# EAGLE design projeto_placa (EAGLE 7.7.0)
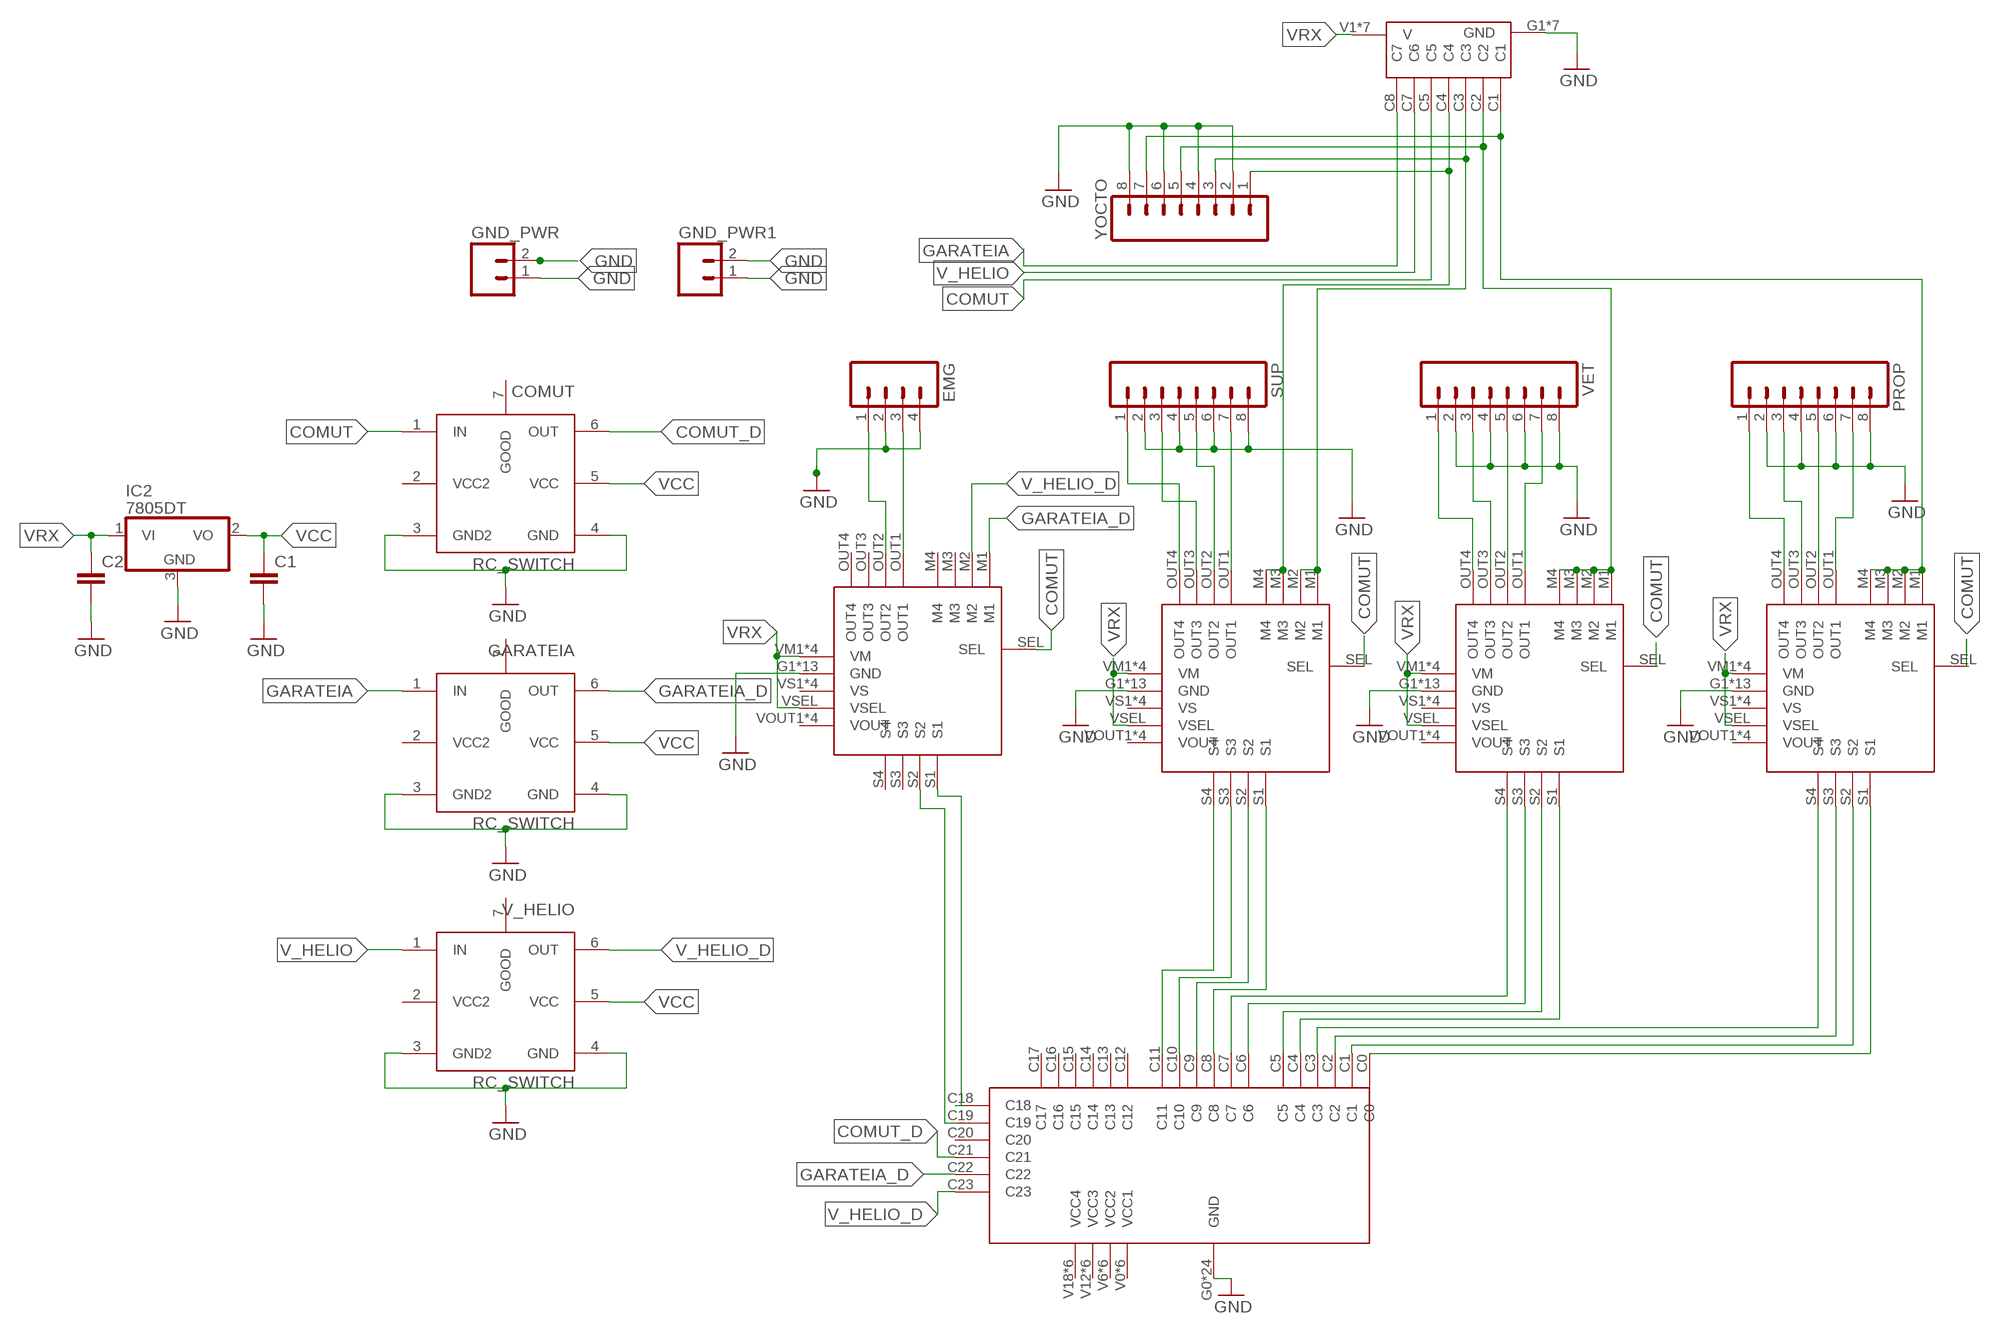
[diagram p0: schematic, sheet 1]

## Parts
C1  C-EUC0805  [C0805]
C2  C-EUC0805  [C0805]
COMUT  RC_SWITCH  [7PINS_POLOLU]
EMG  M04PTH  [1X04]
GARATEIA  RC_SWITCH  [7PINS_POLOLU]
GND_PWR  M025MM  [SCREWTERMINAL-5MM-2]
GND_PWR1  M025MM  [SCREWTERMINAL-5MM-2]
IC2  7805DT  [TO252]
PROP  M08  [1X08_ROUND]
RX_IN  RX_IN  [RX_IN]
SUP  M08  [1X08_ROUND]
U$1  POLOLU_MAESTRO_24CH  [POLOLU_MAESTRO_24]
U$3  POLOLU_MUX_4CH  [POLOLU_MUX]
U$4  POLOLU_MUX_4CH  [POLOLU_MUX]
U$5  POLOLU_MUX_4CH  [POLOLU_MUX]
U$6  POLOLU_MUX_4CH  [POLOLU_MUX]
V_HELIO  RC_SWITCH  [7PINS_POLOLU]
VET  M08  [1X08_ROUND]
YOCTO  M08SILK_FEMALE_PTH  [1X08]

## Nets
COMUT: COMUT.1(IN) RX_IN.C5 U$3.SEL U$4.SEL U$5.SEL U$6.SEL
COMUT_D: COMUT.6(OUT) U$1.C21
GARATEIA: GARATEIA.1(IN) RX_IN.C8(C7)
GARATEIA_D: GARATEIA.6(OUT) U$1.C22 U$6.M1
GND: C1.2 C2.2 COMUT.3(GND2) COMUT.4(GND) EMG.2 EMG.4 GARATEIA.3(GND2) GARATEIA.4(GND) GND_PWR1.1 GND_PWR1.2 GND_PWR.1 GND_PWR.2 IC2.3(GND) PROP.2 PROP.4 PROP.6 PROP.8 RX_IN.G1(GND) RX_IN.G2(GND) RX_IN.G3(GND) RX_IN.G4(GND) RX_IN.G5(GND) RX_IN.G6(GND) RX_IN.G7(GND) SUP.2 SUP.4 SUP.6 SUP.8 U$1.G0(GND) U$1.G1(GND) U$1.G2(GND) U$1.G3(GND) U$1.G4(GND) U$1.G5(GND) U$1.G6(GND) U$1.G7(GND) U$1.G8(GND) U$1.G9(GND) U$1.G10(GND) U$1.G11(GND) U$1.G12(GND) U$1.G13(GND) U$1.G14(GND) U$1.G15(GND) U$1.G16(GND) U$1.G17(GND) U$1.G18(GND) U$1.G19(GND) U$1.G20(GND) U$1.G21(GND) U$1.G22(GND) U$1.G23(GND) U$3.G1(GND) U$3.G2(GND) U$3.G3(GND) U$3.G4(GND) U$3.G5(GND) U$3.G6(GND) U$3.G7(GND) U$3.G8(GND) U$3.G9(GND) U$3.G10(GND) U$3.G11(GND) U$3.G12(GND) U$3.G13(GND) U$4.G1(GND) U$4.G2(GND) U$4.G3(GND) U$4.G4(GND) U$4.G5(GND) U$4.G6(GND) U$4.G7(GND) U$4.G8(GND) U$4.G9(GND) U$4.G10(GND) U$4.G11(GND) U$4.G12(GND) U$4.G13(GND) U$5.G1(GND) U$5.G2(GND) U$5.G3(GND) U$5.G4(GND) U$5.G5(GND) U$5.G6(GND) U$5.G7(GND) U$5.G8(GND) U$5.G9(GND) U$5.G10(GND) U$5.G11(GND) U$5.G12(GND) U$5.G13(GND) U$6.G1(GND) U$6.G2(GND) U$6.G3(GND) U$6.G4(GND) U$6.G5(GND) U$6.G6(GND) U$6.G7(GND) U$6.G8(GND) U$6.G9(GND) U$6.G10(GND) U$6.G11(GND) U$6.G12(GND) U$6.G13(GND) V_HELIO.3(GND2) V_HELIO.4(GND) VET.2 VET.4 VET.6 VET.8 YOCTO.2 YOCTO.4 YOCTO.6 YOCTO.8
N$1: U$1.C0 U$5.S1
N$2: PROP.5 U$5.OUT2
N$3: U$1.C1 U$5.S2
N$4: U$1.C2 U$5.S3
N$5: U$1.C3 U$5.S4
N$6: U$1.C4 U$4.S1
N$7: U$1.C5 U$4.S2
N$8: U$1.C6 U$4.S3
N$9: U$1.C7 U$4.S4
N$10: U$1.C8 U$3.S1
N$11: U$1.C9 U$3.S2
N$12: U$1.C10 U$3.S3
N$13: U$1.C11 U$3.S4
N$14: U$1.C18 U$6.S1
N$15: U$1.C19 U$6.S2
N$16: EMG.3 U$6.OUT1
N$18: PROP.7 U$5.OUT1
N$19: PROP.3 U$5.OUT3
N$20: PROP.1 U$5.OUT4
N$21: U$4.OUT1 VET.7
N$22: U$4.OUT2 VET.5
N$23: U$4.OUT3 VET.3
N$24: U$4.OUT4 VET.1
N$25: SUP.7 U$3.OUT1
N$26: SUP.5 U$3.OUT2
N$27: SUP.3 U$3.OUT3
N$28: SUP.1 U$3.OUT4
N$29: RX_IN.C1 U$5.M1 U$5.M2 U$5.M3 U$5.M4 YOCTO.7
N$30: RX_IN.C2 U$4.M1 U$4.M2 U$4.M3 U$4.M4 YOCTO.5
N$31: RX_IN.C4 U$3.M3 U$3.M4 YOCTO.1
N$33: EMG.1 U$6.OUT2
N$42: RX_IN.C3 U$3.M1 U$3.M2 YOCTO.3
V_HELIO: RX_IN.C7(C6) V_HELIO.1(IN)
V_HELIO_D: U$1.C23 U$6.M2 V_HELIO.6(OUT)
VCC: C1.1 COMUT.5(VCC) GARATEIA.5(VCC) IC2.2(VO) V_HELIO.5(VCC)
VRX: C2.1 IC2.1(VI) RX_IN.V1(V) RX_IN.V2(V) RX_IN.V3(V) RX_IN.V4(V) RX_IN.V5(V) RX_IN.V6(V) RX_IN.V7(V) U$3.VM1(VM) U$3.VM2(VM) U$3.VM3(VM) U$3.VM4(VM) U$3.VSEL U$4.VM1(VM) U$4.VM2(VM) U$4.VM3(VM) U$4.VM4(VM) U$4.VSEL U$5.VM1(VM) U$5.VM2(VM) U$5.VM3(VM) U$5.VM4(VM) U$5.VSEL U$6.VM1(VM) U$6.VM2(VM) U$6.VM3(VM) U$6.VM4(VM) U$6.VSEL
Unconnected: COMUT.2(VCC2) COMUT.7(GOOD) GARATEIA.2(VCC2) GARATEIA.7(GOOD) U$1.C12 U$1.C13 U$1.C14 U$1.C15 U$1.C16 U$1.C17 U$1.C20 U$1.V0(VCC1) U$1.V1(VCC1) U$1.V2(VCC1) U$1.V3(VCC1) U$1.V4(VCC1) U$1.V5(VCC1) U$1.V6(VCC2) U$1.V7(VCC2) U$1.V8(VCC2) U$1.V9(VCC2) U$1.V10(VCC2) U$1.V11(VCC2) U$1.V12(VCC3) U$1.V13(VCC3) U$1.V14(VCC3) U$1.V15(VCC3) U$1.V16(VCC3) U$1.V17(VCC3) U$1.V18(VCC4) U$1.V19(VCC4) U$1.V20(VCC4) U$1.V21(VCC4) U$1.V22(VCC4) U$1.V23(VCC4) U$3.VOUT1(VOUT) U$3.VOUT2(VOUT) U$3.VOUT3(VOUT) U$3.VOUT4(VOUT) U$3.VS1(VS) U$3.VS2(VS) U$3.VS3(VS) U$3.VS4(VS) U$4.VOUT1(VOUT) U$4.VOUT2(VOUT) U$4.VOUT3(VOUT) U$4.VOUT4(VOUT) U$4.VS1(VS) U$4.VS2(VS) U$4.VS3(VS) U$4.VS4(VS) U$5.VOUT1(VOUT) U$5.VOUT2(VOUT) U$5.VOUT3(VOUT) U$5.VOUT4(VOUT) U$5.VS1(VS) U$5.VS2(VS) U$5.VS3(VS) U$5.VS4(VS) U$6.M3 U$6.M4 U$6.OUT3 U$6.OUT4 U$6.S3 U$6.S4 U$6.VOUT1(VOUT) U$6.VOUT2(VOUT) U$6.VOUT3(VOUT) U$6.VOUT4(VOUT) U$6.VS1(VS) U$6.VS2(VS) U$6.VS3(VS) U$6.VS4(VS) V_HELIO.2(VCC2) V_HELIO.7(GOOD)

## Library data of the parts
C1 C2 = rcl:C-EU: CAPACITOR, European symbol
COMUT GARATEIA V_HELIO = pololu:RC_SWITCH
EMG = SparkFun-Connectors:M04: Header 4 Standard 4-pin 0.1" header. Use with straight break away headers (SKU : PRT-00116), right angle break away headers (PRT-00553), swiss pins (PRT-00743), machine pins (PRT-00117), and female headers (PRT-00115). Molex polarized connector foot print use with SKU : PRT-08231 with associated crimp pins and housings. 1MM SMD Version SKU: PRT-10208; PROD_ID: CONN-09696
GND_PWR GND_PWR1 = SparkFun-Connectors:M02: Standard 2-pin 0.1" header. Use with - straight break away headers ( PRT-00116) - right angle break away headers (PRT-00553) - swiss pins (PRT-00743) - machine pins (PRT-00117) - female headers (PRT-00115) Molex polarized connector foot print use with: PRT-08233 with associated crimp pins and housings. 2.54_SCREWTERM for use with PRT-10571. 3.5mm Screw Terminal footprints for PRT-08084 5mm Screw Terminal footprints for use with PRT-08432; STOREFRONT_ID: PRT-08432
IC2 = linear:78*: Positive VOLTAGE REGULATOR Source: http://cache.national.com/ds/LM/LM78L05.pdf http://www.fairchildsemi.com/ds/LM/LM7805.pdf
PROP SUP VET = SparkFun-Connectors:M08: Header 8 Standard 8-pin 0.1" header. Use with straight break away headers (SKU : PRT-00116), right angle break away headers (PRT-00553), swiss pins (PRT-00743), machine pins (PRT-00117), and female headers (PRT-00115).; PROD_ID: CONN-08437
RX_IN = drvc:RX_IN
U$1 = drvc:POLOLU_MAESTRO_24CH
U$3-U$6 = drvc:POLOLU_MUX_4CH
YOCTO = SparkFun-Connectors:M08: Header 8 Standard 8-pin 0.1" header. Use with straight break away headers (SKU : PRT-00116), right angle break away headers (PRT-00553), swiss pins (PRT-00743), machine pins (PRT-00117), and female headers (PRT-00115).; PROD_ID: CONN-08438

## Net classes
0 default: width 0.305 mm, drill 0.508 mm, clearance 0.508 mm

## Board
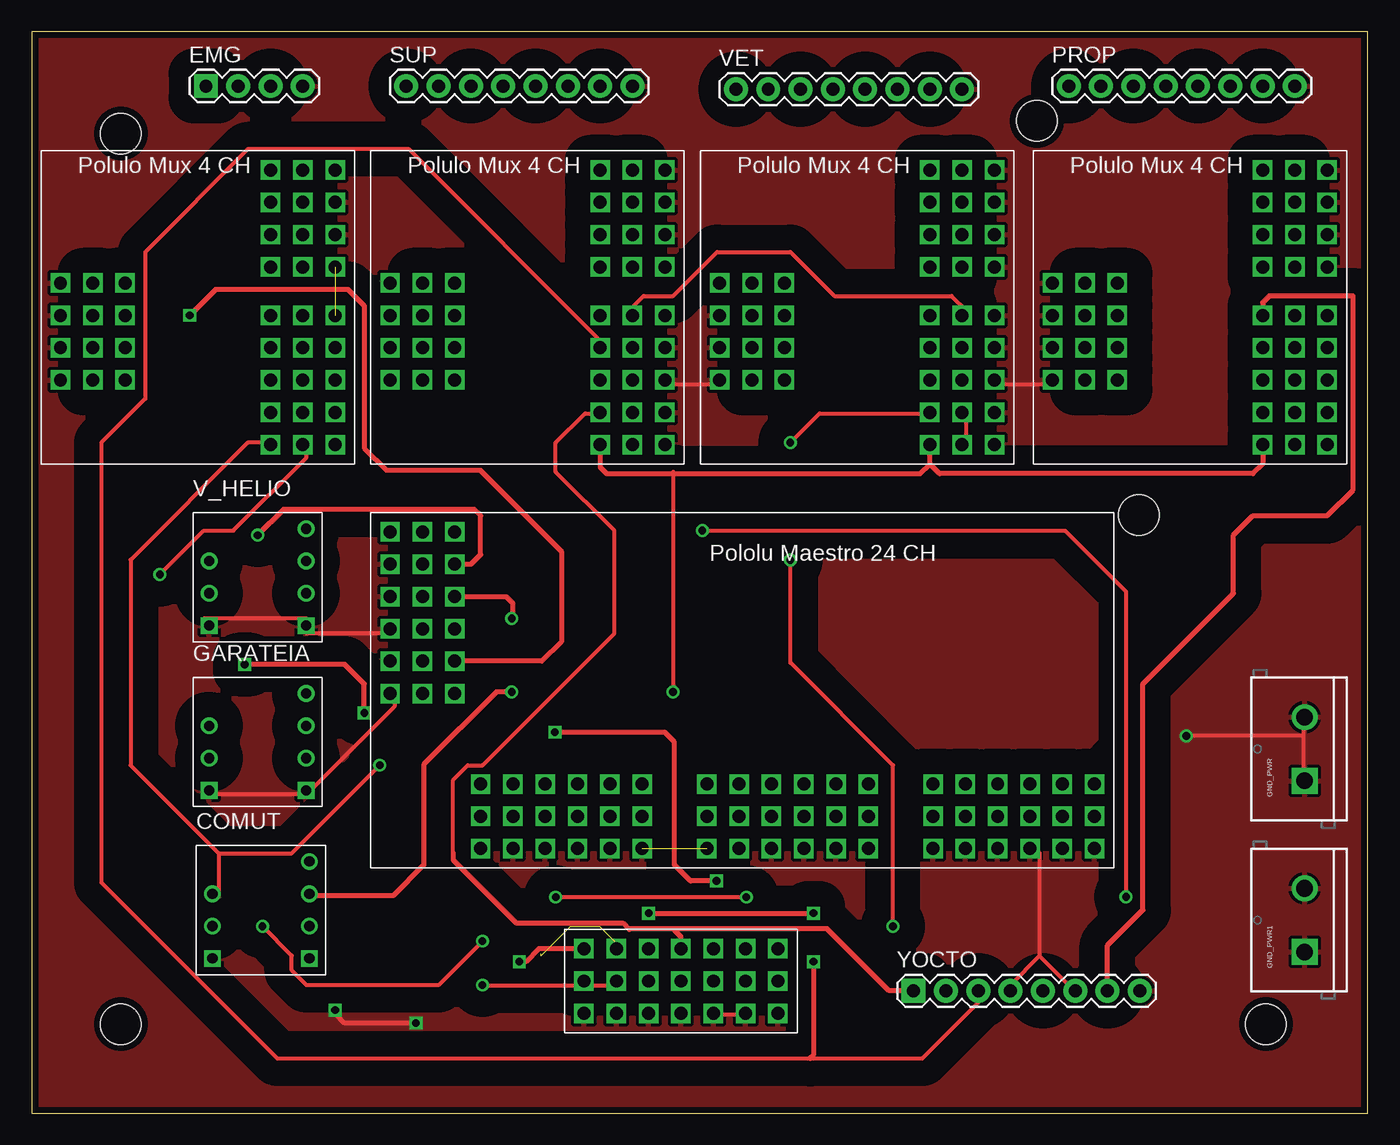
[diagram p1: board, top side]
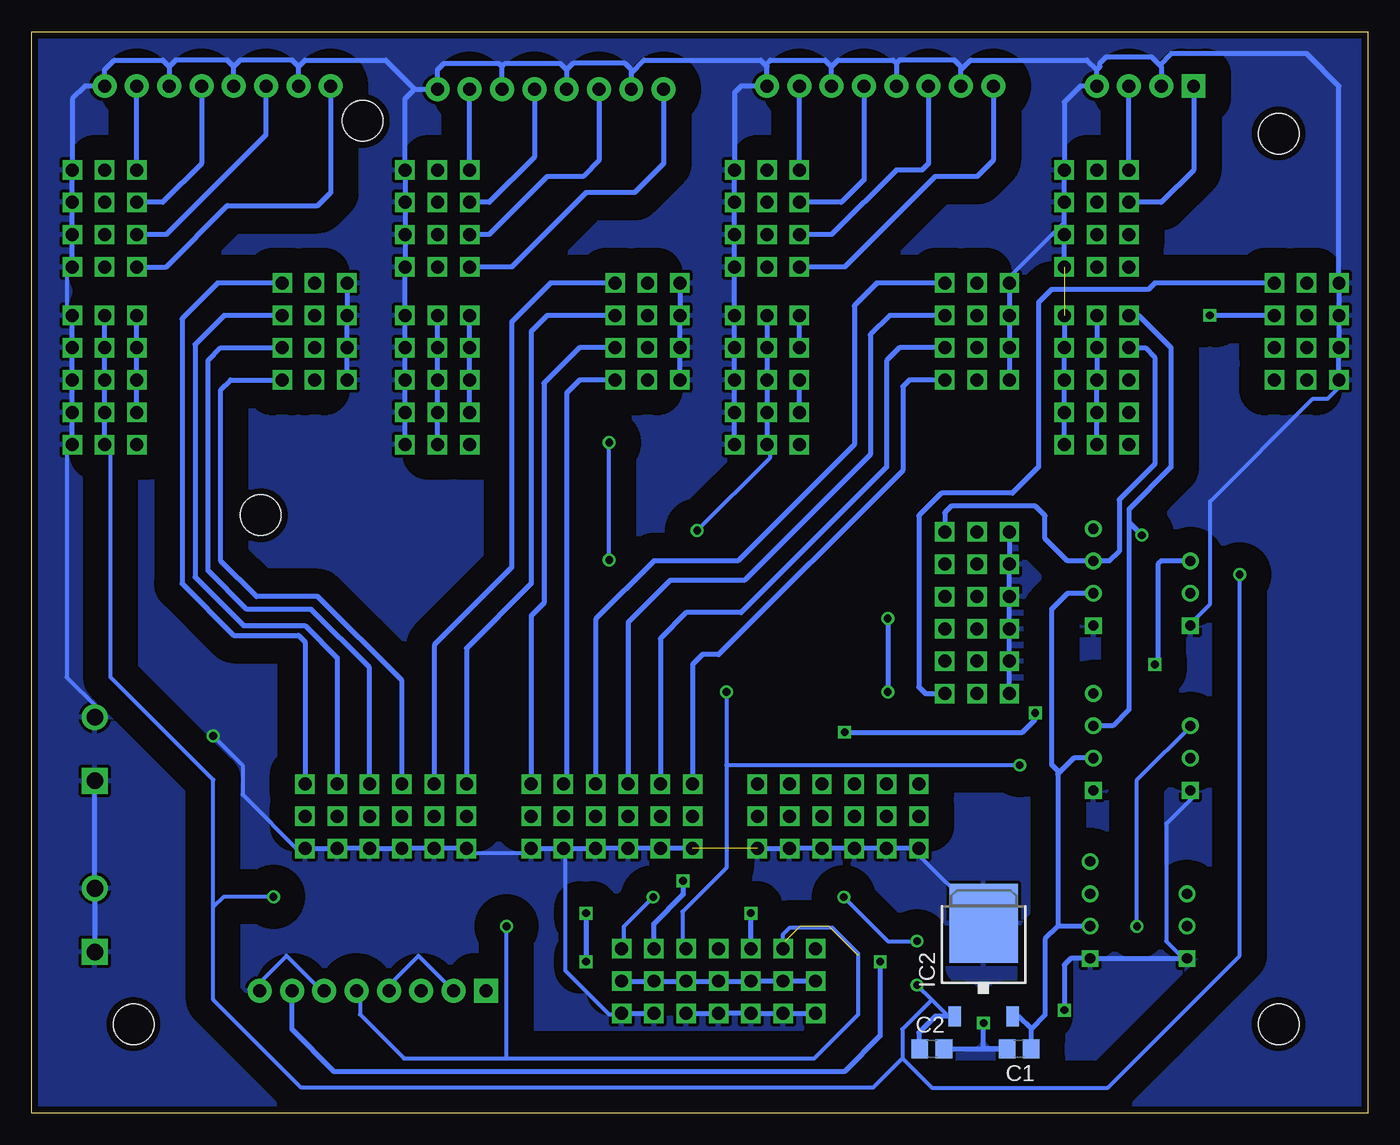
[diagram p2: board, bottom side, seen from below]

Size 105 x 85 mm. Coordinates in mm from the lower left corner, seen from the top.
Outline: 0,0 105,0 105,85 0,85 0,0
Copper layers (1*16): Top 0.035mm / dielectric 1.5mm / Bottom 0.035mm
Design rules "default *": minimum track width 12mil, minimum drill 24mil, track to track 2mm, track to pad 12mil, pad to pad 8mil, via to via 8mil, smd to smd 8mil, copper to edge 20mil, drill to drill 8mil, minimum pad ring 10mil, minimum via ring 8mil, stop-mask expansion 4mil, vias tented up to drill 0mil, thermal gap 10mil
Holes 3.2 mm at 7,7 97,7 7,77 87,47 79,78

### Footprints (pad centres in the part's own frame; a part is rotated, then mirrored left to right if it is on the bottom)
C0805 = smd 1.3 x 1.5: 1 -0.95,0; 2 0.95,0
7PINS_POLOLU = drill 0.8: 1 -3.81,1.27; 2 -3.81,-1.27; 5 3.81,-1.27; 6 3.81,1.27; 7 3.81,3.81 | drill 0.8 square: 3 -3.81,-3.81; 4 3.81,-3.81
1X04 = drill 1.016 pad 1.88 square: 1 0,0 | drill 1.016 pad 1.88: 2 2.54,0; 3 5.08,0; 4 7.62,0
SCREWTERMINAL-5MM-2 = drill 1.3 pad 2.032 square: 1 0,0 | drill 1.3 pad 2.032: 2 5,0
TO252 = smd 1 x 1.6: 1 -2.28,-4.8; 2 2.28,-4.8 | smd 5.4 x 6.2: 3 0,2.5
1X08_ROUND = drill 1.016 pad 1.88: 1 0,0; 2 2.54,0; 3 5.08,0; 4 7.62,0; 5 10.16,0; 6 12.7,0; 7 15.24,0; 8 17.78,0
RX_IN = drill 1.02 square: C1 1.524,1.524; C2 1.524,4.064; C3 1.524,6.604; C4 1.524,9.144; C5 1.524,11.684; C7 1.524,14.224; C8 1.524,16.764; G1 6.604,1.524; G2 6.604,4.064; G3 6.604,6.604; G4 6.604,9.144; G5 6.604,11.684; G6 6.604,14.224; G7 6.604,16.764; V1 4.064,1.524; V2 4.064,4.064; V3 4.064,6.604; V4 4.064,9.144; V5 4.064,11.684; V6 4.064,14.224; V7 4.064,16.764
POLOLU_MAESTRO_24 = drill 1.02 square: C0 6.604,1.524; C1 6.604,4.064; C2 6.604,6.604; C3 6.604,9.144; C4 6.604,11.684; C5 6.604,14.224; C6 6.604,19.304; C7 6.604,21.844; C8 6.604,24.384; C9 6.604,26.924; C10 6.604,29.464; C11 6.604,32.004; C12 6.604,37.084; C13 6.604,39.624; C14 6.604,42.164; C15 6.604,44.704; C16 6.604,47.244; C17 6.604,49.784; C18 13.716,51.816; C19 16.256,51.816; C20 18.796,51.816; C21 21.336,51.816; C22 23.876,51.816; C23 26.416,51.816; G0 1.524,1.524; G1 1.524,4.064; G2 1.524,6.604; G3 1.524,9.144; G4 1.524,11.684; G5 1.524,14.224; G6 1.524,19.304; G7 1.524,21.844; G8 1.524,24.384; G9 1.524,26.924; G10 1.524,29.464; G11 1.524,32.004; G12 1.524,37.084; G13 1.524,39.624; G14 1.524,42.164; G15 1.524,44.704; G16 1.524,47.244; G17 1.524,49.784; G18 13.716,56.896; G19 16.256,56.896; G20 18.796,56.896; G21 21.336,56.896; G22 23.876,56.896; G23 26.416,56.896; V0 4.064,1.524; V1 4.064,4.064; V2 4.064,6.604; V3 4.064,9.144; V4 4.064,11.684; V5 4.064,14.224; V6 4.064,19.304; V7 4.064,21.844; V8 4.064,24.384; V9 4.064,26.924; V10 4.064,29.464; V11 4.064,32.004; V12 4.064,37.084; V13 4.064,39.624; V14 4.064,42.164; V15 4.064,44.704; V16 4.064,47.244; V17 4.064,49.784; V18 13.716,54.356; V19 16.256,54.356; V20 18.796,54.356; V21 21.336,54.356; V22 23.876,54.356; V23 26.416,54.356
POLOLU_MUX = drill 1.02 square: G1 1.524,1.524; G2 1.524,4.064; G3 1.524,6.604; G4 1.524,9.144; G5 1.524,12.954; G6 1.524,15.494; G7 1.524,18.034; G8 1.524,20.574; G9 1.524,23.114; G10 23.114,10.414; G11 23.114,12.954; G12 23.114,15.494; G13 23.114,18.034; M1 6.604,12.954; M2 6.604,15.494; M3 6.604,18.034; M4 6.604,20.574; OUT1 6.604,1.524; OUT2 6.604,4.064; OUT3 6.604,6.604; OUT4 6.604,9.144; S1 18.034,10.414; S2 18.034,12.954; S3 18.034,15.494; S4 18.034,18.034; SEL 6.604,23.114; VM1 4.064,12.954; VM2 4.064,15.494; VM3 4.064,18.034; VM4 4.064,20.574; VOUT1 4.064,1.524; VOUT2 4.064,4.064; VOUT3 4.064,6.604; VOUT4 4.064,9.144; VS1 20.574,10.414; VS2 20.574,12.954; VS3 20.574,15.494; VS4 20.574,18.034; VSEL 4.064,23.114
1X08 = drill 1.016 pad 1.88 square: 1 0,0 | drill 1.016 pad 1.88: 2 2.54,0; 3 5.08,0; 4 7.62,0; 5 10.16,0; 6 12.7,0; 7 15.24,0; 8 17.78,0

### Placement (x,y rotation side)
C1  27.4,5.05 180 bottom
C2  34.26,5.05 0 bottom
COMUT  18,15.97 0 top
EMG  13.68,80.74 0 top
GARATEIA  17.75,29.18 0 top
GND_PWR  100.04,26.13 90 top
GND_PWR1  100.04,12.67 90 top
IC2  30.19,12.41 0 bottom
PROP  81.5,80.74 0 top
RX_IN  41.88,14.45 270 top
SUP  29.43,80.74 0 top
U$1  85.06,19.27 90 top
U$3  51.28,75.66 180 top
U$4  77.18,75.66 180 top
U$5  103.35,75.66 180 top
U$6  25.37,75.66 180 top
V_HELIO  17.75,42.13 0 top
VET  55.34,80.49 0 top
YOCTO  69.31,9.62 0 top

### Tracks (layer width: path | path; a pad name or v marks a point on that pad's centre or on a via)
COMUT  (via drill 0.61)
  Top 0.305: v50.4,33.11 50.4,50.26 50.4,50.4 | 14.68,20.44 14.68,16.98 COMUT.1 | 14.68,20.44 7.76,27.35 7.76,43.49 16.98,52.71 18.13,52.71 U$6.SEL | v27.35,27.35 20.44,20.44 14.68,20.44
  Top 0.406: U$5.SEL 96.74,51.02 95.98,50.26 71.34,50.26 70.58,51.02 | 70.58,51.02 U$4.SEL | U$3.SEL 44.67,50.77 45.18,50.26 50.4,50.26 69.82,50.26 70.58,51.02
  Bottom 0.305: v50.4,33.11 50.4,27.35 | 50.4,27.35 50.4,19.29 53.86,15.83 53.86,13.52 RX_IN.C5 | v27.35,27.35 50.4,27.35
COMUT_D  (via drill 0.61)
  Top 0.406: U$1.C21 37.29,40.61 37.8,40.1 37.8,38.95 v37.72,38.88 | v37.72,33.11 36.52,33.11 30.8,27.4 30.8,19.5 28.4,17.1 21.95,17.1 COMUT.6
  Bottom 0.406: v37.72,38.88 v37.72,33.11
GARATEIA  (via drill 0.61)
  Top 0.305: v18.13,14.68 20.44,12.37 20.44,11.22 21.59,10.07 31.96,10.07 v35.42,13.52 | v56.16,16.98 v41.18,16.98
  Bottom 0.305: v18.13,14.68 18.13,26.2 13.52,30.81 GARATEIA.1 | v35.42,13.52 37.72,13.52 v41.18,16.98 | v56.16,16.98 58.47,14.68 58.47,13.52 RX_IN.C8
GARATEIA_D  (via drill 0.6)
  Top 0.406: U$1.C22 34.51,43.15 35.27,43.91 35.27,46.96 34.77,47.47 19.78,47.47 v17.75,45.43
  Bottom 0.406: U$6.M1 18,62.71 15.46,60.17 15.46,50.77 18.76,47.47 18.76,46.45 | 18.76,46.45 18.76,31.72 20.03,30.45 GARATEIA.6 | 18.76,46.45 v17.75,45.43
GND  (via drill 0.6, 0.61)  (2 unrouted)
  Top 0.305: 79.21,12.37 76.91,10.07 YOCTO.4 | 79.21,12.37 81.52,10.07 YOCTO.6 | RX_IN.G6 56.16,7.76 53.86,7.76 RX_IN.G5 | 79.21,12.37 79.21,20.44 U$1.G2 | 99.95,29.66 99.95,30.81 GND_PWR.2 | 99.95,29.66 99.95,26.2 GND_PWR.1 | V_HELIO.3 13.52,38.88 21.59,38.88 V_HELIO.4 21.59,37.72 28.5,37.72 U$1.G20 | 21.59,25.05 13.52,25.05 GARATEIA.3 | 21.59,25.05 28.5,31.96 28.5,33.11 U$1.G18 | 21.59,25.05 GARATEIA.4 | U$4.G13 53.86,57.31 50.4,57.31 U$3.G7 | U$5.G13 80.36,57.31 75.75,57.31 U$4.G7 | 99.95,29.66 v90.73,29.66
  Top 0.406: v30.19,7.08 24.61,7.08 23.84,7.84 v23.84,8.1
  Bottom 0.305: YOCTO.2 72.3,10.07 74.6,12.37 76.91,10.07 YOCTO.4 | YOCTO.6 82.67,10.07 84.97,12.37 87.28,10.07 YOCTO.8 | IC2.3 30.81,15.83 35.42,20.44 U$1.G17 | RX_IN.G7 58.47,7.76 59.62,7.76 63.08,11.22 63.08,20.44 U$1.G7 | U$1.G5 71.14,20.44 65.38,20.44 U$1.G6 | GND_PWR.2 99.95,31.96 102.26,34.27 102.26,52.71 U$5.G9 | U$3.G10 28.5,65.38 23.9,69.99 23.84,69.99 | COMUT.3 14.68,12.37 15.83,13.52 15.83,22.74 13.52,25.05 GARATEIA.3 | U$6.G13 2,57.31 3.15,56.16 4.3,56.16 12.37,48.1 12.37,40.03 13.52,38.88 V_HELIO.3 | U$5.G5 102.26,63.08 102.26,66.53 U$5.G4 | v90.73,29.66 88.43,27.35 88.43,25.05 83.82,20.44 U$1.G0
  Bottom 0.406: U$6.G13 U$6.G12 U$6.G11 U$6.G10 2.25,80.74 4.79,83.28 15.46,83.28 16.35,82.39 | 21.3,82.01 EMG.4 22.57,80.74 23.84,79.47 U$6.G1 U$6.G2 23.84,69.99 U$6.G3 U$6.G4 | 21.3,82.01 21.05,82.26 21.05,82.52 20.54,83.03 16.99,83.03 16.35,82.39 | 16.35,82.39 16.22,82.26 EMG.2 | 37.05,82.52 36.8,82.77 32.48,82.77 31.97,82.26 SUP.2 31.97,82.01 31.21,82.77 22.07,82.77 21.3,82.01 | 37.05,82.52 SUP.4 | SUP.6 42.13,82.26 | 42.13,82.26 41.62,82.77 37.31,82.77 37.05,82.52 | 47.21,82.26 SUP.8 49.24,80.74 49.75,80.23 U$3.G1 U$3.G2 U$3.G3 U$3.G4 U$3.G5 U$3.G6 U$3.G7 U$3.G8 U$3.G9 | 47.21,82.26 47.21,82.52 46.96,82.77 42.64,82.77 42.13,82.26 | 62.96,82.01 62.45,82.52 58.39,82.52 57.88,82.01 VET.2 57.88,81.76 56.86,82.77 47.72,82.77 47.21,82.26 | 62.96,82.01 VET.4 | VET.6 68.04,82.26 | 68.04,82.26 67.79,82.52 63.47,82.52 62.96,82.01 | 68.04,82.26 68.29,82.52 72.61,82.52 73.12,82.01 VET.8 74.9,80.49 | 94.2,82.26 94.71,82.77 98.52,82.77 99.28,82.01 PROP.8 100.81,80.74 101.82,79.72 U$5.G1 U$5.G2 U$5.G3 U$5.G4 | 94.2,82.26 PROP.6 | PROP.4 89.12,82.26 | 89.12,82.26 89.63,82.77 93.69,82.77 94.2,82.26 | 84.04,82.26 84.55,82.77 88.61,82.77 89.12,82.26 | U$5.G9 U$5.G8 U$5.G7 U$5.G6 U$5.G5 | 74.9,80.49 75.66,79.72 U$4.G1 U$4.G2 U$4.G3 U$4.G4 U$4.G5 U$4.G6 U$4.G7 U$4.G8 U$4.G9 | PROP.2 84.04,82.26 | 84.04,82.26 83.53,82.77 77.18,82.77 74.9,80.49 | U$4.G13 U$4.G12 U$4.G11 U$4.G10 | U$5.G10 U$5.G11 U$5.G12 U$5.G13 | U$6.G5 U$6.G6 U$6.G7 U$6.G8 U$6.G9 | U$1.G23 U$1.G22 U$1.G21 U$1.G20 U$1.G19 U$1.G18 | U$1.G0 U$1.G1 U$1.G2 U$1.G3 U$1.G4 U$1.G5 | U$1.G11 U$1.G10 U$1.G9 U$1.G8 U$1.G7 U$1.G6 | U$1.G12 U$1.G13 U$1.G14 U$1.G15 U$1.G16 U$1.G17
  Bottom 0.406: U$3.G10 U$3.G11 U$3.G12 U$3.G13 | COMUT.3 COMUT.4 23.34,12.16 23.84,11.65 v23.84,8.1 | C2.2 C1.2 30.19,5.05 v30.19,7.08 | RX_IN.G7 RX_IN.G6 | RX_IN.G5 RX_IN.G4 RX_IN.G3 RX_IN.G2 RX_IN.G1 | GND_PWR1.1 GND_PWR1.2 GND_PWR.1
  pour Top: 0.48,0.48 0.48,84.55 104.62,84.55 104.62,79.47 104.62,0.48
  pour Bottom: 0.48,0.48 104.62,0.48 104.62,84.55 0.48,84.55
  pour Top: 61.3,44.3 80,44.3 84.7,39.6 84.7,30.4 84.1,29.8 82.4,28.1 68.8,28.1 62.3,34.6 61,35.9 61,44
N$1
  Bottom 0.406: U$5.S1 90.39,65.25 93.19,62.45 93.19,41.62 89.12,37.56 84.04,37.56 83.53,37.05 U$1.C0
N$2
  Bottom 0.406: PROP.5 91.66,74.64 94.71,71.6 U$5.OUT2
N$3
  Bottom 0.406: U$5.S2 89.88,62.71 92.17,60.42 92.17,42.13 88.36,38.32 83.53,38.32 80.99,35.78 U$1.C1
N$4
  Bottom 0.406: U$1.C2 78.45,35.02 83.03,39.59 88.11,39.59 91.15,42.64 91.15,59.15 90.14,60.17 U$5.S3
N$5
  Bottom 0.406: U$1.C3 75.91,34 82.52,40.61 87.34,40.61 90.14,43.4 90.14,56.86 89.38,57.63 U$5.S4
N$6
  Bottom 0.406: U$4.S1 64.23,65.25 67.28,62.2 67.28,42.89 73.37,36.8 U$1.C4
N$7
  Bottom 0.406: U$4.S2 64.48,62.71 65.75,61.44 65.75,41.62 70.83,36.54 U$1.C5
N$8
  Bottom 0.406: U$4.S3 61.94,60.17 64.74,57.37 64.74,40.1 65.75,39.08 U$1.C6
N$9
  Bottom 0.406: U$4.S4 61.94,57.63 62.96,56.61 62.96,26.13 U$1.C7
N$10
  Bottom 0.406: U$3.S1 38.58,65.25 40.35,63.47 40.35,52.55 49.5,43.4 56.1,43.4 60.67,38.83 U$1.C8
N$11
  Bottom 0.406: U$3.S2 37.56,62.71 39.08,61.18 39.08,51.78 48.99,41.88 54.83,41.88 58.13,38.58 U$1.C9
N$12
  Bottom 0.406: U$3.S3 36.8,60.17 37.81,59.15 37.81,50.77 49.24,39.34 53.56,39.34 55.59,37.31 U$1.C10
N$13
  Bottom 0.406: U$3.S4 36.04,57.63 36.54,57.12 36.54,50.51 51.02,36.04 52.29,36.04 53.05,35.27 U$1.C11
N$14
  Bottom 0.406: U$6.S1 16.73,65.25 17.24,64.74 24.86,64.74 25.88,63.72 25.88,50.77 27.91,48.74 33.5,48.74 35.27,46.96 35.27,33.5 34.77,32.99 U$1.C18
N$15  (via drill 0.6)
  Top 0.406: v12.41,62.71 14.45,64.74 24.86,64.74 26.13,63.47 26.13,52.29 27.91,50.51 35.27,50.51 41.62,44.16 41.62,37.05 40.1,35.53 U$1.C19
  Bottom 0.406: U$6.S2 v12.41,62.71
N$16
  Bottom 0.406: U$6.OUT1 EMG.3
N$18
  Bottom 0.406: U$5.OUT1 PROP.7
N$19
  Bottom 0.406: U$5.OUT3 94.44,69.06 86.6,76.9 86.6,80.72 PROP.3
N$20
  Bottom 0.406: PROP.1 81.5,72.36 82.52,71.34 89.63,71.34 94.46,66.52 U$5.OUT4
N$21
  Bottom 0.406: U$4.OUT1 VET.7
N$22
  Bottom 0.406: VET.5 65.5,75.15 69.06,71.6 U$4.OUT2
N$23
  Bottom 0.406: VET.3 60.42,74.9 61.69,73.63 64.48,73.63 69.06,69.06 U$4.OUT3
N$24
  Bottom 0.406: VET.1 55.34,74.64 57.63,72.36 61.44,72.36 67.28,66.52 U$4.OUT4
N$25
  Bottom 0.406: U$3.OUT1 SUP.7
N$26
  Bottom 0.406: SUP.5 39.59,73.37 41.37,71.6 U$3.OUT2
N$27
  Bottom 0.406: SUP.3 34.51,74.64 35.02,74.14 37.05,74.14 42.13,69.06 U$3.OUT3
N$28
  Bottom 0.406: SUP.1 29.43,74.9 30.7,73.63 34,73.63 41.12,66.52 U$3.OUT4
N$29  (via drill 0.6)
  Top 0.406: YOCTO.7 84.55,13.18 87.34,15.97 87.34,33.75 94.46,40.86 94.46,45.43 95.98,46.96 101.82,46.96 103.85,48.99 103.85,64.23 97.25,64.23 96.74,63.72 U$5.M1 | RX_IN.C1 39.85,12.92 38.83,11.91 v38.32,11.91
  Bottom 0.406: U$5.M1 U$5.M2 U$5.M3 U$5.M4 | v38.32,11.91 38.32,6.06 41.12,3.27 81.25,3.27 84.55,6.57 YOCTO.7
N$30  (via drill 0.61)  (4 unrouted)
  Top 0.305: v59.62,52.71 61.92,55.01 69.99,55.01 U$4.M4 | v59.62,43.49 59.62,35.42 67.69,27.35 v67.69,14.68
  Bottom 0.305: 67.69,4.3 75.75,4.3 79.21,7.76 79.21,8.91 YOCTO.5 | 67.69,4.3 43.49,4.3 40.03,7.76 40.03,12.53 42.1,14.6 45.4,14.6 45.94,14.06 RX_IN.C2 | v59.62,43.49 v59.62,52.71 | 67.69,4.3 v67.69,14.68
  Bottom 0.406: U$4.M1 U$4.M2 U$4.M3 U$4.M4
N$31
  Top 0.305: 33.11,20.44 33.11,26.2 34.27,27.35 35.42,27.35 45.79,37.72 45.79,45.79 41.18,50.4 41.18,52.71 43.49,55.01 44.64,55.01 U$3.M4
  Top 0.406: 33.11,20.44 33.11,19.91 38.07,14.95 46.45,14.95 46.96,14.45 47.01,14.5 50.5,14.5 50.51,14.49 50.51,14.45 | 50.51,14.45 50.51,14.39 51,13.9 51,12.94 RX_IN.C4 | YOCTO.1 67.38,9.62 62.5,14.5 50.57,14.5 50.51,14.45
  Bottom 0.406: U$3.M4 U$3.M3
N$33
  Bottom 0.406: EMG.1 13.68,74.14 16.22,71.6 U$6.OUT2
N$42  (via drill 0.6)
  Top 0.305: YOCTO.3 74.6,8.91 69.99,4.3 61.18,4.3 19.29,4.3 5.46,18.13 5.46,52.71 8.91,56.16 8.91,67.69 16.98,75.75 29.66,75.75 44.64,60.77 U$3.M2
  Top 0.406: v48.48,15.72 v61.44,15.72 | v61.44,11.91 61.44,4.56 61.18,4.3
  Bottom 0.406: U$3.M2 U$3.M1 | RX_IN.C3 v48.48,15.72 | v61.44,15.72 v61.44,11.91
V_HELIO  (via drill 0.6)
  Top 0.406: v53.82,18.26 51.78,18.26 50.51,19.53 50.51,29.18 49.75,29.94 v41.12,29.94 | v26.13,31.46 26.13,33.75 24.61,35.27 v16.73,35.27
  Bottom 0.406: V_HELIO.1 16.22,43.4 16.48,43.15 16.48,35.53 v16.73,35.27 | v41.12,29.94 27.15,29.94 26.13,30.96 v26.13,31.46 | v53.82,18.26 53.82,17.18 56.1,14.9 RX_IN.C7
V_HELIO_D
  Bottom 0.406: U$1.C23 33.24,47.21 32.73,47.72 26.13,47.72 25.37,46.96 25.37,45.18 23.59,43.4 V_HELIO.6 20.29,43.4 19.53,44.16 19.53,48.23 16.73,51.02 16.73,59.4 17.49,60.17 U$6.M2
VCC
  Bottom 0.406: C1.1 26.45,6.64 | 26.45,6.64 27.4,7.59 27.89,7.59 IC2.2 | COMUT.5 24.35,14.7 | 24.35,14.7 25.37,13.68 25.37,7.72 26.45,6.64 | GARATEIA.5 23.08,27.91 24.23,26.77 | 24.23,26.77 24.35,26.64 24.35,14.7 | V_HELIO.5 23.59,40.86 24.86,39.59 24.86,27.4 24.23,26.77
VRX  (via drill 0.6, 0.61)
  Top 0.305: U$4.VM4 73.45,55.01 73.45,52.71 U$4.VSEL | U$4.VM1 73.45,63.08 72.3,64.23 63.08,64.23 59.62,67.69 53.86,67.69 50.4,64.23 48.1,64.23 46.94,63.08 U$3.VM1 | 43.49,10.07 45.79,10.07 RX_IN.V2 | v35.42,10.07 43.49,10.07 | 43.49,10.07 RX_IN.V1 | v10.07,42.33 13.52,45.79 15.83,45.79 21.59,51.55 21.59,52.71 U$6.VSEL | v52.71,45.79 81.21,45.79 86,41 v86,17
  Bottom 0.305: 34.27,8.91 33.11,7.76 33.11,7.61 | 34.27,8.91 v35.42,10.07 | v10.07,42.33 10.07,12.37 20.44,2 34.27,2 36.57,4.3 | 36.57,4.3 36.57,6.61 34.27,8.91 | 90.73,16.2 90.73,8.91 83.82,2 38.88,2 36.57,4.3 | 90.73,16.2 90.73,26.2 98.8,34.27 98.8,52.71 U$5.VSEL | v52.71,45.79 46.94,51.55 46.94,52.71 U$3.VSEL | 86.02,16.98 v86,17 89.94,17 90.73,16.2
  Bottom 0.406: U$3.VM1 U$3.VM2 U$3.VM3 U$3.VM4 U$3.VSEL | U$6.VM1 U$6.VM2 U$6.VM3 U$6.VM4 U$6.VSEL | U$4.VSEL U$4.VM3 U$4.VM2 U$4.VM1 | U$5.VSEL U$5.VM4 U$5.VM3 U$5.VM2 U$5.VM1 | IC2.1 33.11,7.61 33.98,7.61 35.27,6.32 35.27,5.11 C2.1 | RX_IN.V1 RX_IN.V3 RX_IN.V4 RX_IN.V5 RX_IN.V6 RX_IN.V7